# Altium schematic sheet Power.SchDoc
size 420 x 297 mm; SheetNumber: 1; SheetTotal: 6
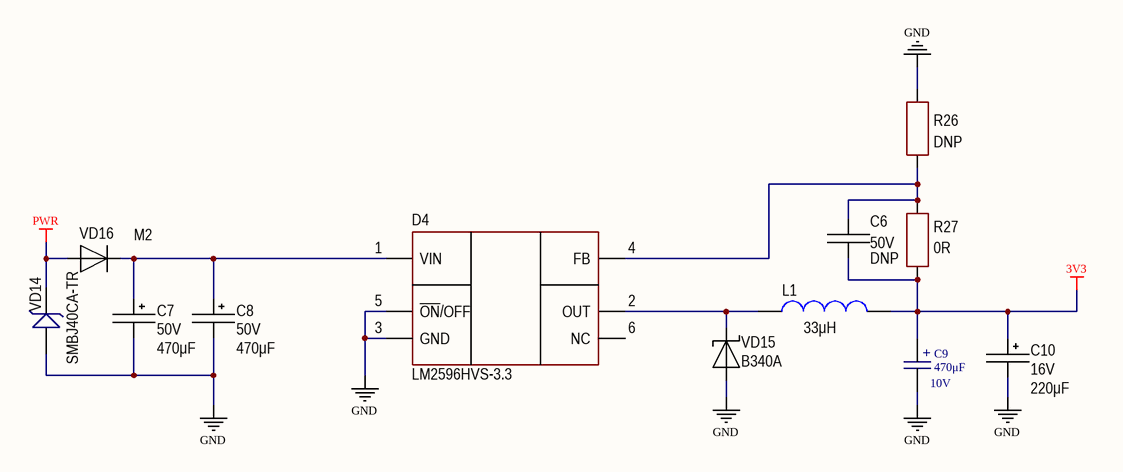
[diagram p0: Power.SchDoc]

## Parts
C6  value DNP  Voltage: 50V  [CAP: 1206]
C7  value 470μF  Voltage: 50V  [CAP: D10C5H20]
C8  value 470μF  Voltage: 50V  [CAP: D10C5H20]
C9  value 470μF  Voltage: 10V  [CAP8x10.5]  (hidden comment: Capacitor_Polar)
C10  value 220μF  Voltage: 16V  [CAP: SMD D6.3A6.6H7.7]
D4  (no value)  [TO263-5L]
L1  value 33μH  [IND: SRP7028A]
R26  value DNP  [RES: 1206]
R27  value 0R  [RES: 1206]
VD14  value SMBJ40CA-TR  [SMB]  (hidden comment: suppressor)
VD15  PartNumber: B340A  [DIODE: SMA]
VD16  PartNumber: M2  [DIODE: SMA]

## Nets
3V3: C6.1 C9.1 C10.1 L1.1 R27.1
GND: C7.2 C8.2 C9.2 C10.2 D4.3(GND) D4.5(~{ON}/OFF) R26.2 VD14.2 VD15.1
PWR: VD14.1 VD16.1
NetC6_2: C6.2 D4.4(FB) R26.1 R27.2
NetC7_1: C7.1 C8.1 D4.1(VIN) VD16.2
NetD4_2: D4.2(OUT) L1.2 VD15.2

Not connected (* = marked no-connect by the designer): D4 6(NC)

## Notes on the sheet
- Подп. и дата
- Инв. № дубл.
- Взам. инв. №
- Инв. № подл.
- Изм.
- Лист
- № докум.
- Подп.
- Дата
- 2.106-A3
- Копировал
- Формат А3
- (in symbol Capacitor_Polar) +

## Library data of the parts
C6 = Ceramic_1206: Manufacturer: Yageo; PartNumber: CC1206KRX7R9BB104; ValueManufacturerPartNumber: Ceramic capacitor, DNP, X7R, ±10%, 50V, 1206, -55...+125°C; TypeCapacitor: Ceramic capacitor; Tolerance: ±10%; TypeDielectric: X7R; Package: 1206; HelpURL: https://www.digikey.com/product-detail/en/yageo/CC1206KRX7R9BB104/311-1179-1-ND/303089; Temperature: -55...+125°C
C7 C8 = Aluminium: ECAP (К50-35), 470мкФ, 50В, 105°C, 20%, 10x20мм P:5мм; Manufacturer: Wurth; ValueManufacturerPartNumber: Aluminium capacitor, 470μF, 50V, ±20%, 54mOhm, 14x10x5 mm, -55...+105°C; TypeCapacitor: Aluminium capacitor; Impedance: 54mOhm; PartNumber: ECAP (К50-35); Package: 14x10x5 mm; HelpURL: https://www.digikey.com/product-detail/en/wurth-electronics-inc/860080475013/732-9029-1-ND/5728972; Temperature: -55...+105°C; Tolerance: ±20%
C9 = Capacitor_Polar: PartNumber: JCK1A471M080105
C10 = Aluminium: Manufacturer: Wurth; PartNumber: JCK1C221M063077; ValueManufacturerPartNumber: Aluminium capacitor, 220μF, 16V, ±20%, 54mOhm, 14x10x5 mm, -55...+105°C; TypeCapacitor: Aluminium capacitor; Tolerance: ±20%; Impedance: 54mOhm; Package: 14x10x5 mm; HelpURL: https://www.digikey.com/product-detail/en/wurth-electronics-inc/860080475013/732-9029-1-ND/5728972; Temperature: -55...+105°C
D4 = LM2596HVS-3.3: Buck converter; Manufacturer: Texas Instruments; ValueManufacturerPartNumber: DC/DC buck converter, 45V, 52MHz, 3.3V, 5A, -40...+125°C, TO263-5L; VoltageInput: 45V; Frequency: 52MHz; CurrentOutput: 5A; VoltageOutput: 3.3V; Package: TO263-5L; ComponentType: DC/DC buck converter; Temperature: -40...+125°C; PartNumber: LM2596HVS-3.3
L1 = Inductor_SRP7028A: FAUL0630-330MT / BMRA00060630330MA1; Manufacturer: Bourns; PartNumber: SRP7028A-330M; ValueManufacturerPartNumber: Fixed inductor, 33μH, ±20%, SRP7028A, 5.5A, -40...+150°C; TypeInductor: Fixed inductor; MaxCurrent: 5.5A; Tolerance: ±20%; Package: SRP7028A; Temperature: -40...+150°C
R26 = Resistor_1206: Manufacturer: Yageo; PartNumber: RC1206JR-07100RL; ValueManufacturerPartNumber: Resistor film, DNP, ±5%, 1206, 0.25W, -55...+125°C; TypeResistor: Resistor film; Power: 0.25W; Tolerance: ±5%; Package: 1206; HelpURL: https://www.digikey.com/product-detail/en/yageo/RC1206JR-07100RL/311-100ERCT-ND/732153; Temperature: -55...+125°C
R27 = Resistor_1206: Manufacturer: Yageo; PartNumber: RC1206JR-07100RL; ValueManufacturerPartNumber: Resistor film, 0R, ±5%, 1206, 0.25W, -55...+125°C; TypeResistor: Resistor film; Power: 0.25W; Tolerance: ±5%; Package: 1206; HelpURL: https://www.digikey.com/product-detail/en/yageo/RC1206JR-07100RL/311-100ERCT-ND/732153; Temperature: -55...+125°C
VD15 = Schottky_single: ValueManufacturerPartNumber: Schottky diode, 80V, 500mA, 1V, 15pF, SMA, -55...+150°C; TypeDiode: Schottky diode; Voltage: 80V; Current: 500mA; VoltageDrop: 1V; RecoveryTime: 15pF; Package: SMA; HelpURL: https://www.chipdip.ru/product/b340a; Temperature: -55...+150°C
VD16 = Diode_single: Manufacturer: Micro Commercial; ValueManufacturerPartNumber: Single diode, 75V, 150mA, 1V, 4ns, SOD-323, -55...+150°C; TypeDiode: Single diode; Voltage: 75V; Current: 150mA; VoltageDrop: 1V; RecoveryTime: 4ns; Package: SOD-323; HelpURL: https://www.digikey.com/product-detail/en/micro-commercial-co/1N4148WX-TP/1N4148WXTPMSCT-ND/717312; Temperature: -55...+150°C